# Altium schematic sheet LED_Matrix.SchDoc
size A3; SheetNumber: 3; SheetTotal: 3
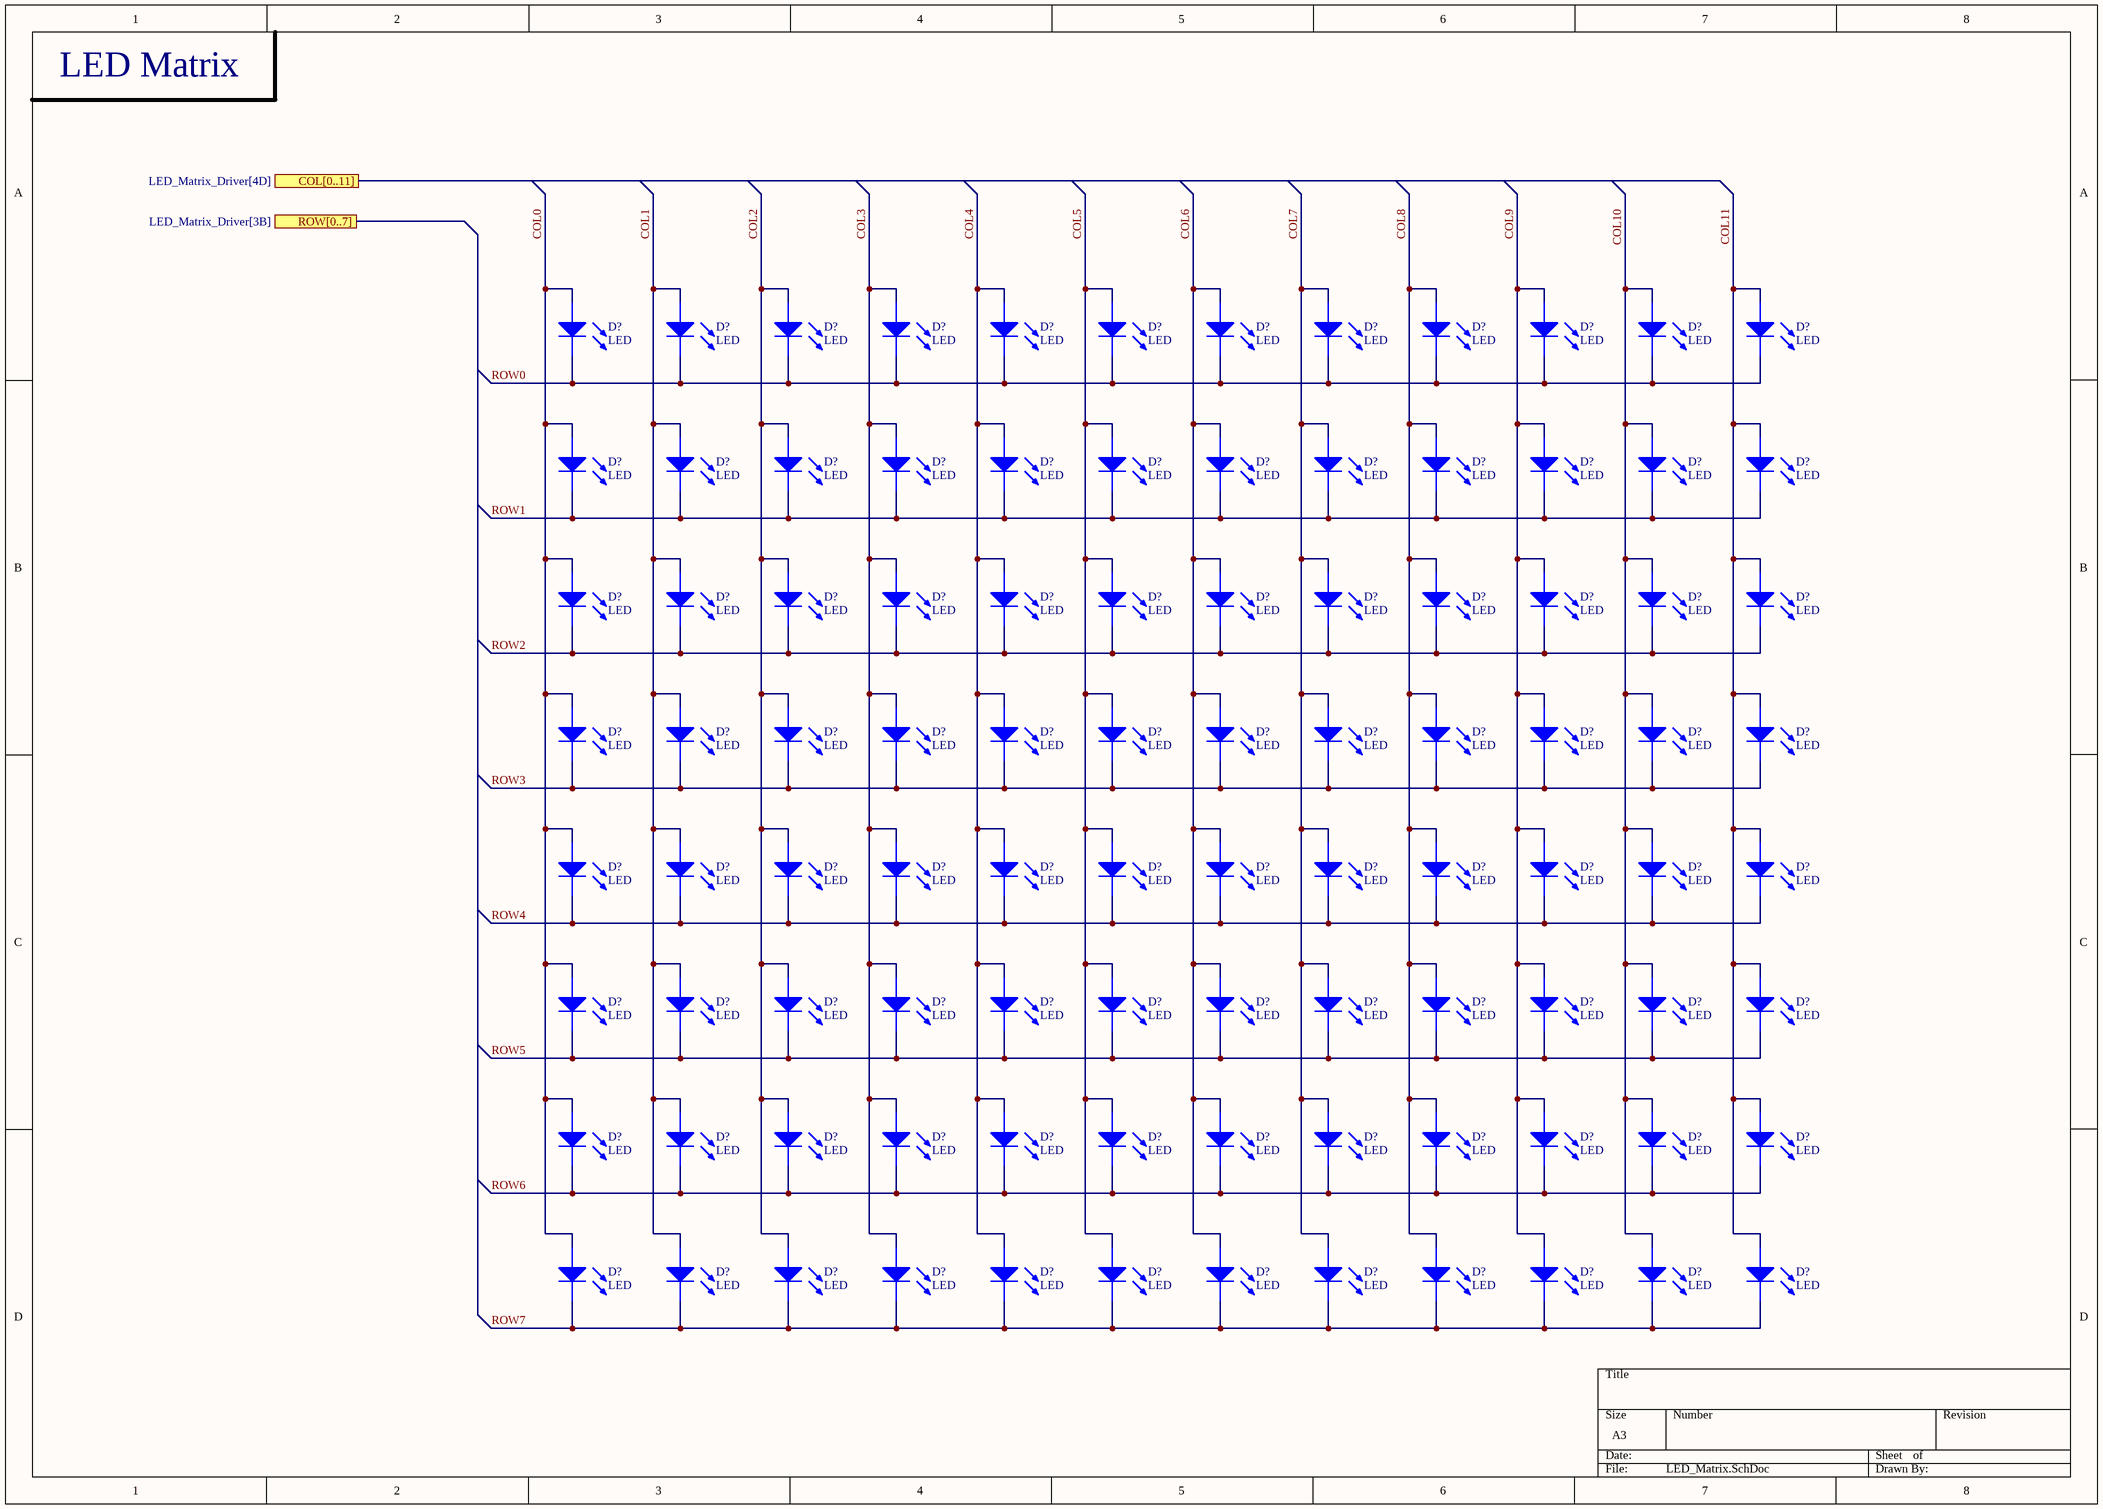
[diagram p0: LED_Matrix.SchDoc]

## Parts
(Parts that share a designator on the sheet are numbered #1, #2 ... from top to bottom, then left to right.)
D?#1  LED  [LEDM2012X80N]
D?#2  LED  [LEDM2012X80N]
D?#3  LED  [LEDM2012X80N]
D?#4  LED  [LEDM2012X80N]
D?#5  LED  [LEDM2012X80N]
D?#6  LED  [LEDM2012X80N]
D?#7  LED  [LEDM2012X80N]
D?#8  LED  [LEDM2012X80N]
D?#9  LED  [LEDM2012X80N]
D?#10  LED  [LEDM2012X80N]
D?#11  LED  [LEDM2012X80N]
D?#12  LED  [LEDM2012X80N]
D?#13  LED  [LEDM2012X80N]
D?#14  LED  [LEDM2012X80N]
D?#15  LED  [LEDM2012X80N]
D?#16  LED  [LEDM2012X80N]
D?#17  LED  [LEDM2012X80N]
D?#18  LED  [LEDM2012X80N]
D?#19  LED  [LEDM2012X80N]
D?#20  LED  [LEDM2012X80N]
D?#21  LED  [LEDM2012X80N]
D?#22  LED  [LEDM2012X80N]
D?#23  LED  [LEDM2012X80N]
D?#24  LED  [LEDM2012X80N]
D?#25  LED  [LEDM2012X80N]
D?#26  LED  [LEDM2012X80N]
D?#27  LED  [LEDM2012X80N]
D?#28  LED  [LEDM2012X80N]
D?#29  LED  [LEDM2012X80N]
D?#30  LED  [LEDM2012X80N]
D?#31  LED  [LEDM2012X80N]
D?#32  LED  [LEDM2012X80N]
D?#33  LED  [LEDM2012X80N]
D?#34  LED  [LEDM2012X80N]
D?#35  LED  [LEDM2012X80N]
D?#36  LED  [LEDM2012X80N]
D?#37  LED  [LEDM2012X80N]
D?#38  LED  [LEDM2012X80N]
D?#39  LED  [LEDM2012X80N]
D?#40  LED  [LEDM2012X80N]
D?#41  LED  [LEDM2012X80N]
D?#42  LED  [LEDM2012X80N]
D?#43  LED  [LEDM2012X80N]
D?#44  LED  [LEDM2012X80N]
D?#45  LED  [LEDM2012X80N]
D?#46  LED  [LEDM2012X80N]
D?#47  LED  [LEDM2012X80N]
D?#48  LED  [LEDM2012X80N]
D?#49  LED  [LEDM2012X80N]
D?#50  LED  [LEDM2012X80N]
D?#51  LED  [LEDM2012X80N]
D?#52  LED  [LEDM2012X80N]
D?#53  LED  [LEDM2012X80N]
D?#54  LED  [LEDM2012X80N]
D?#55  LED  [LEDM2012X80N]
D?#56  LED  [LEDM2012X80N]
D?#57  LED  [LEDM2012X80N]
D?#58  LED  [LEDM2012X80N]
D?#59  LED  [LEDM2012X80N]
D?#60  LED  [LEDM2012X80N]
D?#61  LED  [LEDM2012X80N]
D?#62  LED  [LEDM2012X80N]
D?#63  LED  [LEDM2012X80N]
D?#64  LED  [LEDM2012X80N]
D?#65  LED  [LEDM2012X80N]
D?#66  LED  [LEDM2012X80N]
D?#67  LED  [LEDM2012X80N]
D?#68  LED  [LEDM2012X80N]
D?#69  LED  [LEDM2012X80N]
D?#70  LED  [LEDM2012X80N]
D?#71  LED  [LEDM2012X80N]
D?#72  LED  [LEDM2012X80N]
D?#73  LED  [LEDM2012X80N]
D?#74  LED  [LEDM2012X80N]
D?#75  LED  [LEDM2012X80N]
D?#76  LED  [LEDM2012X80N]
D?#77  LED  [LEDM2012X80N]
D?#78  LED  [LEDM2012X80N]
D?#79  LED  [LEDM2012X80N]
D?#80  LED  [LEDM2012X80N]
D?#81  LED  [LEDM2012X80N]
D?#82  LED  [LEDM2012X80N]
D?#83  LED  [LEDM2012X80N]
D?#84  LED  [LEDM2012X80N]
D?#85  LED  [LEDM2012X80N]
D?#86  LED  [LEDM2012X80N]
D?#87  LED  [LEDM2012X80N]
D?#88  LED  [LEDM2012X80N]
D?#89  LED  [LEDM2012X80N]
D?#90  LED  [LEDM2012X80N]
D?#91  LED  [LEDM2012X80N]
D?#92  LED  [LEDM2012X80N]
D?#93  LED  [LEDM2012X80N]
D?#94  LED  [LEDM2012X80N]
D?#95  LED  [LEDM2012X80N]
D?#96  LED  [LEDM2012X80N]

## Ports
COL[0..11] (see LED_Matrix_Driver[4D]), ROW[0..7] (see LED_Matrix_Driver[3B])

## Nets
COL0: D?#1.2(A) D?#13.2(A) D?#25.2(A) D?#37.2(A) D?#49.2(A) D?#61.2(A) D?#73.2(A) D?#85.2(A)
COL1: D?#2.2(A) D?#14.2(A) D?#26.2(A) D?#38.2(A) D?#50.2(A) D?#62.2(A) D?#74.2(A) D?#86.2(A)
COL2: D?#3.2(A) D?#15.2(A) D?#27.2(A) D?#39.2(A) D?#51.2(A) D?#63.2(A) D?#75.2(A) D?#87.2(A)
COL3: D?#4.2(A) D?#16.2(A) D?#28.2(A) D?#40.2(A) D?#52.2(A) D?#64.2(A) D?#76.2(A) D?#88.2(A)
COL4: D?#5.2(A) D?#17.2(A) D?#29.2(A) D?#41.2(A) D?#53.2(A) D?#65.2(A) D?#77.2(A) D?#89.2(A)
COL5: D?#6.2(A) D?#18.2(A) D?#30.2(A) D?#42.2(A) D?#54.2(A) D?#66.2(A) D?#78.2(A) D?#90.2(A)
COL6: D?#7.2(A) D?#19.2(A) D?#31.2(A) D?#43.2(A) D?#55.2(A) D?#67.2(A) D?#79.2(A) D?#91.2(A)
COL7: D?#8.2(A) D?#20.2(A) D?#32.2(A) D?#44.2(A) D?#56.2(A) D?#68.2(A) D?#80.2(A) D?#92.2(A)
COL8: D?#9.2(A) D?#21.2(A) D?#33.2(A) D?#45.2(A) D?#57.2(A) D?#69.2(A) D?#81.2(A) D?#93.2(A)
COL9: D?#10.2(A) D?#22.2(A) D?#34.2(A) D?#46.2(A) D?#58.2(A) D?#70.2(A) D?#82.2(A) D?#94.2(A)
COL10: D?#11.2(A) D?#23.2(A) D?#35.2(A) D?#47.2(A) D?#59.2(A) D?#71.2(A) D?#83.2(A) D?#95.2(A)
COL11: D?#12.2(A) D?#24.2(A) D?#36.2(A) D?#48.2(A) D?#60.2(A) D?#72.2(A) D?#84.2(A) D?#96.2(A)
ROW0: D?#1.1(K) D?#2.1(K) D?#3.1(K) D?#4.1(K) D?#5.1(K) D?#6.1(K) D?#7.1(K) D?#8.1(K) D?#9.1(K) D?#10.1(K) D?#11.1(K) D?#12.1(K)
ROW1: D?#13.1(K) D?#14.1(K) D?#15.1(K) D?#16.1(K) D?#17.1(K) D?#18.1(K) D?#19.1(K) D?#20.1(K) D?#21.1(K) D?#22.1(K) D?#23.1(K) D?#24.1(K)
ROW2: D?#25.1(K) D?#26.1(K) D?#27.1(K) D?#28.1(K) D?#29.1(K) D?#30.1(K) D?#31.1(K) D?#32.1(K) D?#33.1(K) D?#34.1(K) D?#35.1(K) D?#36.1(K)
ROW3: D?#37.1(K) D?#38.1(K) D?#39.1(K) D?#40.1(K) D?#41.1(K) D?#42.1(K) D?#43.1(K) D?#44.1(K) D?#45.1(K) D?#46.1(K) D?#47.1(K) D?#48.1(K)
ROW4: D?#49.1(K) D?#50.1(K) D?#51.1(K) D?#52.1(K) D?#53.1(K) D?#54.1(K) D?#55.1(K) D?#56.1(K) D?#57.1(K) D?#58.1(K) D?#59.1(K) D?#60.1(K)
ROW5: D?#61.1(K) D?#62.1(K) D?#63.1(K) D?#64.1(K) D?#65.1(K) D?#66.1(K) D?#67.1(K) D?#68.1(K) D?#69.1(K) D?#70.1(K) D?#71.1(K) D?#72.1(K)
ROW6: D?#73.1(K) D?#74.1(K) D?#75.1(K) D?#76.1(K) D?#77.1(K) D?#78.1(K) D?#79.1(K) D?#80.1(K) D?#81.1(K) D?#82.1(K) D?#83.1(K) D?#84.1(K)
ROW7: D?#85.1(K) D?#86.1(K) D?#87.1(K) D?#88.1(K) D?#89.1(K) D?#90.1(K) D?#91.1(K) D?#92.1(K) D?#93.1(K) D?#94.1(K) D?#95.1(K) D?#96.1(K)

## Notes on the sheet
- LED Matrix

## Library data of the parts
D?#1-D?#96 = LED: General Purpose LED; ComponentLink1Description: Datasheet; ComponentLink1URL: https://www.smc-diodes.com/propdf/1N4148W%20N0571%20REV.E.pdf